# EasyEDA schematic Schematic ACSI2STM Compact EasyEda.json
TITLE: ACSI2STM Compact with JLCPCB parts; REV: 1.0; Date: 2023-07-13; Sheet: 1/1; Drawn By: Jean-Matthieu Coulon; Company: retro16
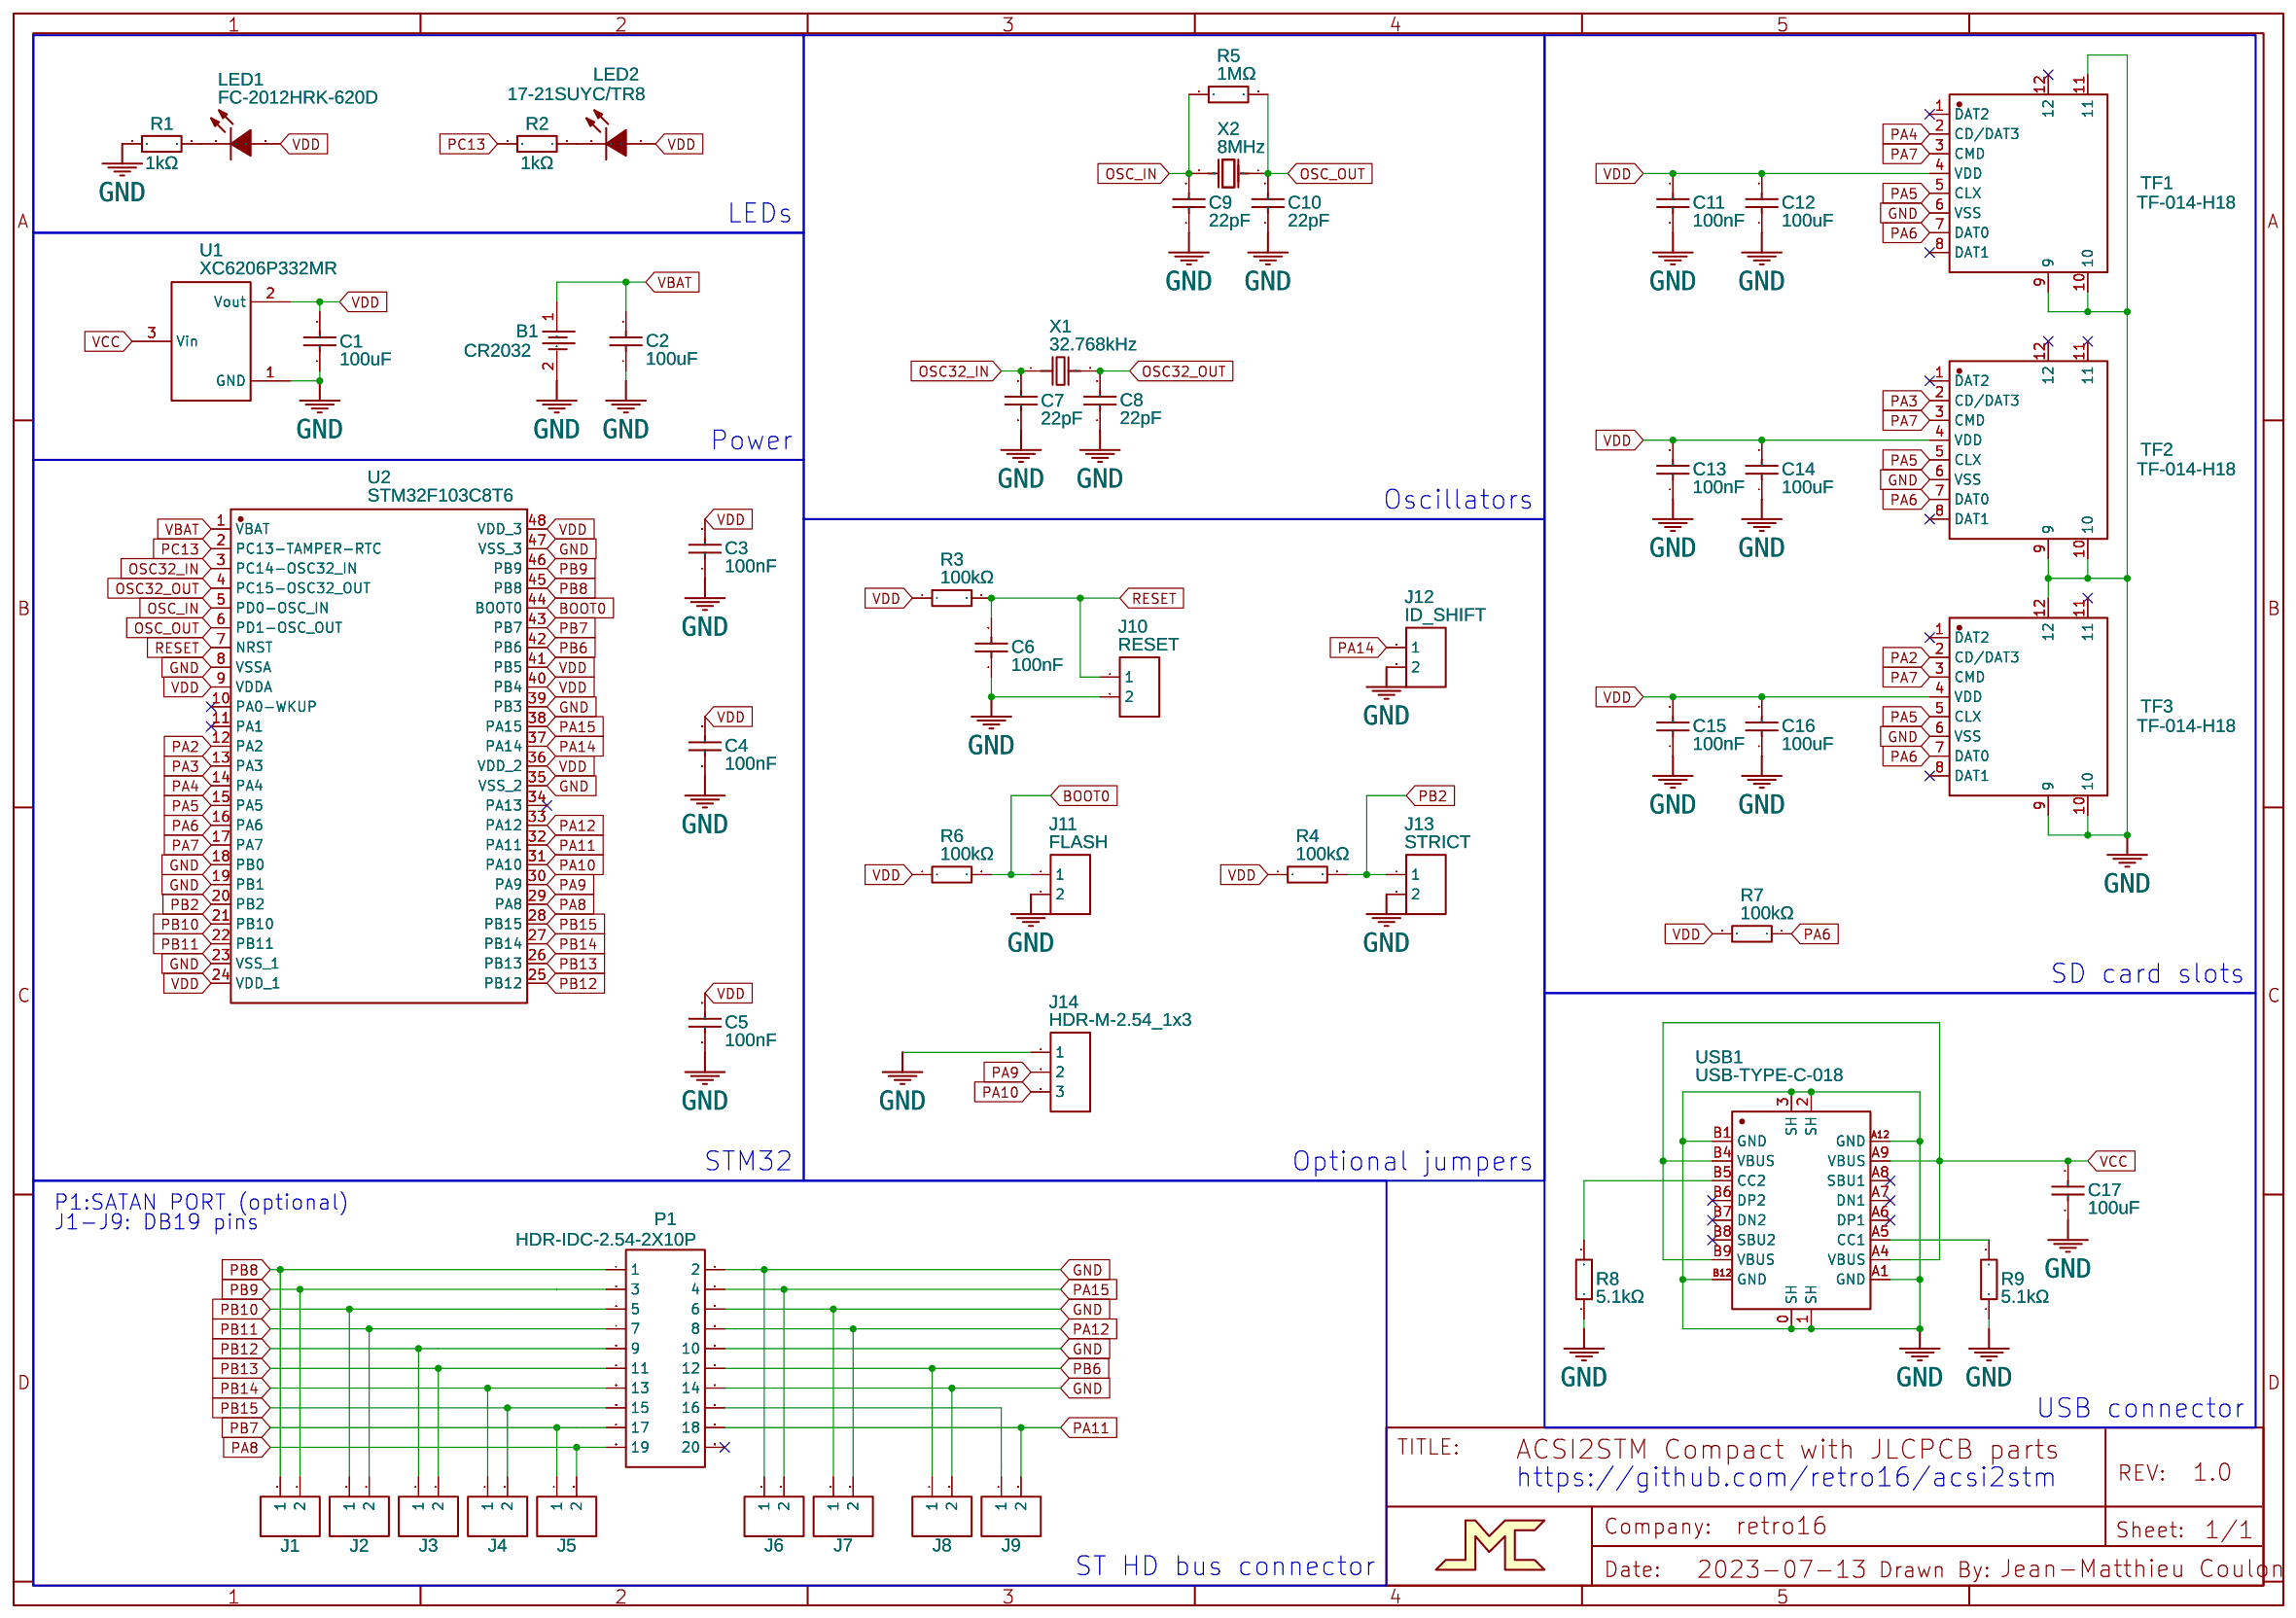
[diagram p0: schematic sheet]

## Parts
B1  CR2032  [BAT-TH_CR2032-BS-6-1]
C1  100uF  [C1206]
C2  100uF  [C1206]
C3  100nF  [C0402]
C4  100nF  [C0402]
C5  100nF  [C0402]
C6  100nF  [C0402]
C7  22pF  [C0402]
C8  22pF  [C0402]
C9  22pF  [C0402]
C10  22pF  [C0402]
C11  100nF  [C0402]
C12  100uF  [C1206]
C13  100nF  [C0402]
C14  100uF  [C1206]
C15  100nF  [C0402]
C16  100uF  [C1206]
C17  100uF  [C1206]
J1  HDR-M-2.54_1x2  [HDR-M-2.54_1X2]
J2  HDR-M-2.54_1x2  [HDR-M-2.54_1X2]
J3  HDR-M-2.54_1x2  [HDR-M-2.54_1X2]
J4  HDR-M-2.54_1x2  [HDR-M-2.54_1X2]
J5  HDR-M-2.54_1x2  [HDR-M-2.54_1X2]
J6  HDR-M-2.54_1x2  [HDR-M-2.54_1X2]
J7  HDR-M-2.54_1x2  [HDR-M-2.54_1X2]
J8  HDR-M-2.54_1x2  [HDR-M-2.54_1X2]
J9  HDR-M-2.54_1x2  [HDR-M-2.54_1X2]
J10  RESET  [HDR-M-2.54_1X2]
J11  FLASH  [HDR-M-2.54_1X2]
J12  ID_SHIFT  [HDR-M-2.54_1X2]
J13  STRICT  [HDR-M-2.54_1X2]
J14  HDR-M-2.54_1x3  [HDR-M-2.54_1X3]
LED1  FC-2012HRK-620D  [LED0805-RD_RED]
LED2  17-21SUYC/TR8  [LED0805-R-RD]
P1  HDR-IDC-2.54-2X10P  [IDC-TH_20P-P2.54-V-R2-C10-S2.54]
R1  1kΩ  [R0402]
R2  1kΩ  [R0402]
R3  100kΩ  [R0402]
R4  100kΩ  [R0402]
R5  1MΩ  [R0402]
R6  100kΩ  [R0402]
R7  100kΩ  [R0402]
R8  5.1kΩ  [R0402]
R9  5.1kΩ  [R0402]
TF1  TF-014-H18  [TF-SMD_TF-014-H18]
TF2  TF-014-H18  [TF-SMD_TF-014-H18]
TF3  TF-014-H18  [TF-SMD_TF-014-H18]
U1  XC6206P332MR  [SOT-23-3_L2.9-W1.6-P1.90-LS2.8-BR]
U2  STM32F103C8T6  [LQFP-48_L7.0-W7.0-P0.50-LS9.0-BL]
U3  JMC_LOGO  [JMC_LOGO]
USB1  USB-TYPE-C-018  [USB-C_SMD-TYPE-C-31-M-12]
X1  32.768kHz  [FC-135R_L3.2-W1.5]
X2  8MHz  [CRYSTAL-SMD_L11.5-W4.8-LS12.7]

## Library data of the parts
B1 = CR2032-BS-6-1: Supplier: LCSC; Manufacturer: Q&J; Supplier Part: C70377; JLCPCB Part Class: Extended Part
C1 C2 C12 C14 C16 C17 = CL31A107MQHNNNE: Supplier: LCSC; Manufacturer: SAMSUNG(三星); Supplier Part: C15008; JLCPCB Part Class: Basic Part
C3-C6 C11 C13 C15 = CL05B104KO5NNNC: Supplier: LCSC; Manufacturer: SAMSUNG(三星); Supplier Part: C1525; JLCPCB Part Class: Basic Part
C7-C10 = 0402CG220J500NT: Supplier: LCSC; Manufacturer: FH(风华); Supplier Part: C1555; JLCPCB Part Class: Basic Part
J1-J13 = HDR-M-2.54_1x2: Supplier Part: C124375; Supplier: LCSC; Contributor: LCEDA_Lib
J14 = HDR-M-2.54_1x3: Supplier Part: C180248; Supplier: LCSC; Contributor: LCEDA_Lib
LED1 = FC-2012HRK-620D: Supplier: LCSC; Manufacturer: 国星光电; Manufacturer Part: NCD0805R1; Supplier Part: C84256; JLCPCB Part Class: Basic Part
LED2 = 17-21SUYC/TR8: Supplier: LCSC; Manufacturer: KENTO; Manufacturer Part: KT-0805黄灯; Supplier Part: C2296; JLCPCB Part Class: Basic Part
P1 = HDR-IDC-2.54-2X10P: Supplier: LCSC; Manufacturer: BOOMELE; Manufacturer Part: IDC Box 2.54mm 2X10P　Straight; image: //image.lceda.cn/szlcsc/C3405.jpg; Supplier Part: C3405
R1 R2 = 0402WGF1001TCE: Supplier: LCSC; Manufacturer: UNI-ROYAL(厚声); Supplier Part: C11702; Resistance (Ohms): 1K; JLCPCB Part Class: Basic Part
R3 R4 R6 R7 = 0402WGF1003TCE: Supplier: LCSC; Manufacturer: UNI-ROYAL(厚声); Supplier Part: C25741; Resistance (Ohms): 100K; JLCPCB Part Class: Basic Part
R5 = 0402WGF1004TCE: Supplier: LCSC; Manufacturer: UNI-ROYAL(厚声); Supplier Part: C26083; Resistance (Ohms): 1M; JLCPCB Part Class: Basic Part
R8 R9 = 0402WGF5101TCE: Supplier: LCSC; Manufacturer: UNI-ROYAL(厚声); Supplier Part: C25905; Resistance (Ohms): 5.1K; JLCPCB Part Class: Basic Part
TF1-TF3 = TF-014-H18: Supplier: LCSC; Supplier Part: C410349; Manufacturer: HANBO(汉博); Contributor: LCSC; JLCPCB Part Class: Extended Part
U1 = XC6206P332MR: Supplier: LCSC; Manufacturer: TOREX(特瑞仕); Supplier Part: C5446; JLCPCB Part Class: Basic Part
U2 = STM32F103C8T6: Supplier: LCSC; Manufacturer: ST(意法半导体); Supplier Part: C8734; JLCPCB Part Class: Basic Part
U3 = JMC_LOGO: Contributor: jmclabexperience
USB1 = USB-TYPE-C-018: Supplier: LCSC; Supplier Part: C2927038; Manufacturer: DEALON(德艺隆); Contributor: LCSC; JLCPCB Part Class: Extended Part
X1 = Q13FC1350000400: Supplier: LCSC; Manufacturer: EPSON(爱普生); Supplier Part: C32346; JLCPCB Part Class: Basic Part
X2 = X49SM8MSD2SC: Supplier: LCSC; Manufacturer: YXC(扬兴晶振); Supplier Part: C12674; JLCPCB Part Class: Basic Part

## Nets
GND: B1.2 C1.1 C2.1 C3.1 C4.1 C5.1 C6.1 C7.1 C8.1 C9.1 C10.1 C11.1 C12.1 C13.1 C14.1 C15.1 C16.1 C17.1 J6.1 J7.1 J8.2 J10.2 J11.2 J12.2 J13.2 J14.1 P1.2 P1.6 P1.10 P1.14 R1.1 R8.1 R9.1 TF1.6(VSS) TF1.9 TF1.10 TF1.11 TF2.6(VSS) TF2.9 TF2.10 TF3.6(VSS) TF3.9 TF3.10 TF3.12 U1.1(GND) U2.8(VSSA) U2.18(PB0) U2.19(PB1) U2.23(VSS_1) U2.35(VSS_2) U2.39(PB3) U2.47(VSS_3) USB1.0(SH) USB1.1(SH) USB1.2(SH) USB1.3(SH) USB1.A1(GND) USB1.A12(GND) USB1.B1(GND) USB1.B12(GND)
VBAT: B1.1 C2.2 U2.1(VBAT)
VCC: C17.2 U1.3(Vin) USB1.A4(VBUS) USB1.A9(VBUS) USB1.B4(VBUS) USB1.B9(VBUS)
VDD: C1.2 C3.2 C4.2 C5.2 C11.2 C12.2 C13.2 C14.2 C15.2 C16.2 LED1.2(+) LED2.1(+) R3.1 R4.1 R6.1 R7.2 TF1.4(VDD) TF2.4(VDD) TF3.4(VDD) U1.2(Vout) U2.9(VDDA) U2.24(VDD_1) U2.36(VDD_2) U2.40(PB4) U2.41(PB5) U2.48(VDD_3)
BOOT0: J11.1 R6.2 U2.44(BOOT0)
OSC32_IN: C7.2 U2.3(PC14-OSC32_IN) X1.1
OSC32_OUT: C8.2 U2.4(PC15-OSC32_OUT) X1.2
OSC_IN: C9.2 R5.1 U2.5(PD0-OSC_IN) X2.2(OSC2)
OSC_OUT: C10.2 R5.2 U2.6(PD1-OSC_OUT) X2.1(OSC1)
PA2: TF3.2(CD/DAT3) U2.12(PA2)
PA3: TF2.2(CD/DAT3) U2.13(PA3)
PA4: TF1.2(CD/DAT3) U2.14(PA4)
PA5: TF1.5(CLX) TF2.5(CLX) TF3.5(CLX) U2.15(PA5)
PA6: R7.1 TF1.7(DAT0) TF2.7(DAT0) TF3.7(DAT0) U2.16(PA6)
PA7: TF1.3(CMD) TF2.3(CMD) TF3.3(CMD) U2.17(PA7)
PA8: J5.2 P1.19 U2.29(PA8)
PA9: J14.2 U2.30(PA9)
PA10: J14.3 U2.31(PA10)
PA11: J9.2 P1.18 U2.32(PA11)
PA12: J7.2 P1.8 U2.33(PA12)
PA14: J12.1 U2.37(PA14)
PA15: J6.2 P1.4 U2.38(PA15)
PB2: J13.1 R4.2 U2.20(PB2)
PB6: J8.1 P1.12 U2.42(PB6)
PB7: J5.1 P1.17 U2.43(PB7)
PB8: J1.1 P1.1 U2.45(PB8)
PB9: J1.2 P1.3 U2.46(PB9)
PB10: J2.1 P1.5 U2.21(PB10)
PB11: J2.2 P1.7 U2.22(PB11)
PB12: J3.1 P1.9 U2.25(PB12)
PB13: J3.2 P1.11 U2.26(PB13)
PB14: J4.1 P1.13 U2.27(PB14)
PB15: J4.2 P1.15 U2.28(PB15)
PC13: R2.1 U2.2(PC13-TAMPER-RTC)
RESET: C6.2 J10.1 R3.2 U2.7(NRST)
Net-(J9-1): J9.1 P1.16
Net-(LED1-1): LED1.1(-) R1.2
Net-(LED2-2): LED2.2(-) R2.2
Net-(R8-2): R8.2 USB1.B5(CC2)
Net-(R9-2): R9.2 USB1.A5(CC1)

Not connected (* = marked no-connect by the designer): P1 20*; TF1 1(DAT2)* 8(DAT1)* 12*; TF2 1(DAT2)* 8(DAT1)* 11* 12*; TF3 1(DAT2)* 8(DAT1)* 11*; U2 10(PA0-WKUP)* 11(PA1)* 34(PA13)*; USB1 A6(DP1)* A7(DN1)* A8(SBU1)* B6(DP2)* B7(DN2)* B8(SBU2)*

## Notes on the sheet
- LEDs
- Power
- Oscillators
- SD card slots
- STM32
- Optional jumpers
- J1-J9: DB19 pins
- P1:SATAN PORT (optional)
- USB connector
- https://github.com/retro16/acsi2stm
- ST HD bus connector
